# EAGLE schematic BpodTeensyShield (EAGLE 7.7.0)
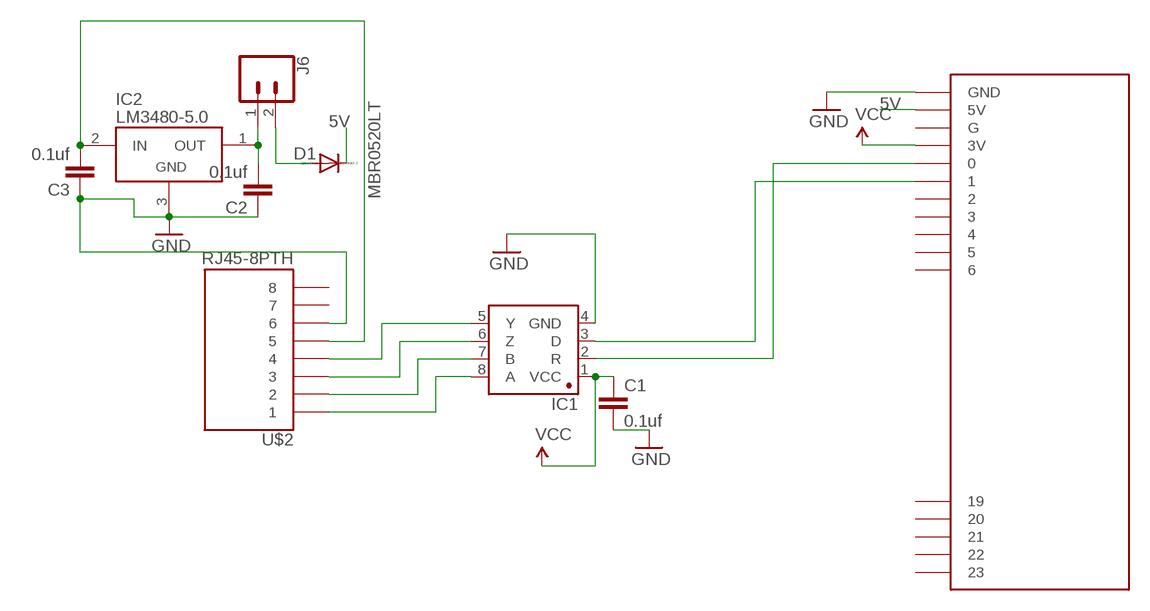
[diagram p0: schematic, sheet 1]

## Parts
C1  0.1uf  CAP1206  [1206@1]
C2  0.1uf  CAP1206  [1206@1]
C3  0.1uf  CAP1206  [1206@1]
D1  MBR0520LT  [SOD123]
IC1  SN65HVD31DR  [SO08]
IC2  LM3480-5.0  [SOT-23-3]
J6  CONN_02  [1X02]
U$1  AUDIOSHIELD  [AUDIOSHIELD]
U$2  RJ45-8PTH  [RJ45-8]

## Nets
5V: D1.C U$1.5V
GND: C1.2 C2.1 C3.1 IC1.4(GND) IC2.3(GND) U$1.GND U$2.6
N$7: IC1.8(A) U$2.1
N$8: IC1.7(B) U$2.2
N$9: IC1.6(Z) U$2.3
N$10: IC1.5(Y) U$2.4
N$14: C2.2 IC2.1(OUT) J6.1
N$18: D1.A J6.2
N$24: C3.2 IC2.2(IN) U$2.5
RX1: IC1.2(R) U$1.0
TX1: IC1.3(D) U$1.1
VCC: C1.1 IC1.1(VCC) U$1.3V
Unconnected: U$1.2 U$1.3 U$1.4 U$1.5 U$1.6 U$1.19 U$1.20 U$1.21 U$1.22 U$1.23 U$1.G U$2.7 U$2.8

## Notes on the sheet
- 5V
- 5V

## Library data of the parts
C1-C3 = SparkFun-Capacitors:CAP: Capacitor Standard 0603 ceramic capacitor, and 0.1" leaded capacitor.
D1 = diode:MBR0520LT: SCHOTTKY BARRIER RECTIFIER Source: http://onsemi.com .. MBR0520LT1-D.pdf
IC1 = Joshparts4:SN65HVD31DR: A placeholder for generic narrow & wide SOIC8 foorptints - used on the DIP adapter board.
IC2 = regulators:LM3480-*: National Semiconductor LM3480 100 mA, SOT-23, quasi-LDO linear regulator
J6 = SparkFun-Connectors:CONN_02: Multi connection point. Often used as Generic Header-pin footprint for 0.1 inch spaced/style header connections On any of the 0.1 inch spaced packages, you can populate with these: Break Away Headers - Straight <https://www.sparkfun.com/products/116> (PRT-00116) Break Away Male Headers - Right Angle <https://www.sparkfun.com/products/553> (PRT-00553) Female Headers <https://www.sparkfun.com/products/115> (PRT-00115) Break Away Headers - Machine Pin <https://www.sparkfun.com/products/117> (PRT-00117) Break Away Female Headers - Swiss Machine Pin <https://www.sparkfun.com/products/743> (PRT-00743) For SCREWTERMINALS and SPRING TERMINALS visit here: Screw Terimnals on SparkFun.com <https://www.sparkfun.com/search/results?term=Screw+Terminals> (5mm/3.5mm/2.54mm spacing) This device is also useful as a general connection point to wire up your design to another part of your project. Our various solder wires solder well into these plated through hole pads. Hook-Up Wire - Assortment (Stranded, 22 AWG) <https://www.sparkfun.com/products/11375> (PRT-11375) Hook-Up Wire - Assortment (Solid Core, 22 AWG) <https://www.sparkfun.com/products/11367> (PRT-11367) View the entire wire category on our website here <https://www.sparkfun.com/categories/141> Special notes: Molex polarized connector foot print use with: PRT-08233 with associated crimp pins and housings. 2.54_SCREWTERM for use with PRT-10571. 3.5mm Screw Terminal footprints for PRT-08084 5mm Screw Terminal footprints for use with PRT-08432
U$1 = Teensy_Audioshield:AUDIOSHIELD: Teensy 3 Audioshield by PJRC.COM
U$2 = SparkFun:RJ45-8: RJ45 Jack Simple RJ45, 8-pin connection - connector for common Cat5, Cat5e, and Cat6 Ethernet cables. Footprint not yet proven in production. Connector sku is PRT-00643; Breakout PCB sku is BOB-00716.